# EAGLE schematic Progetto16sens (EAGLE 9.6.2)
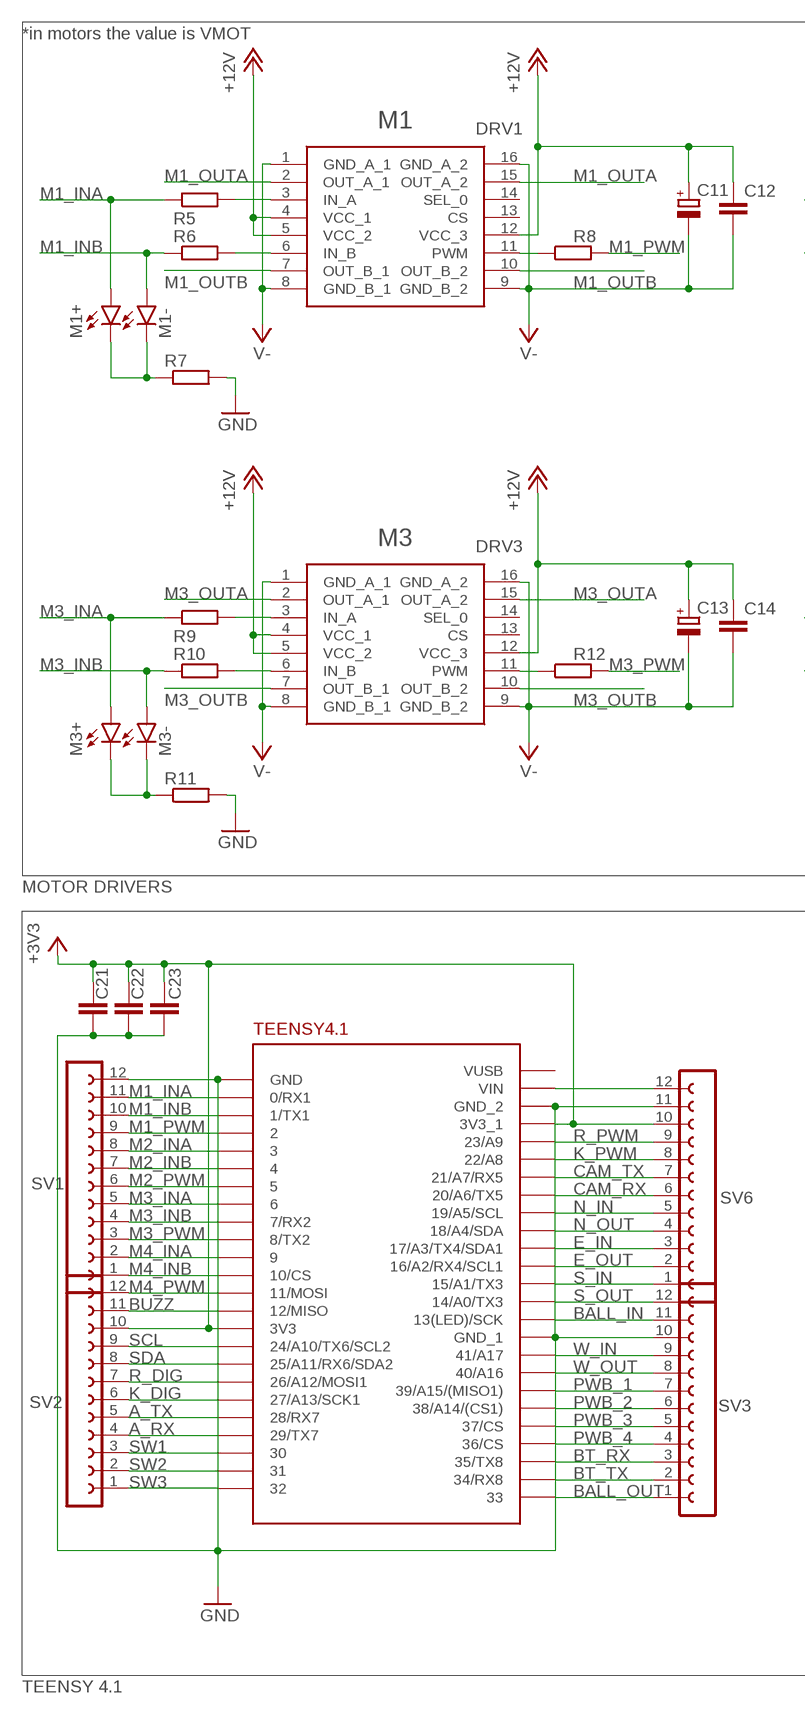
[diagram p0: schematic, sheet 1, part 1 of 2]
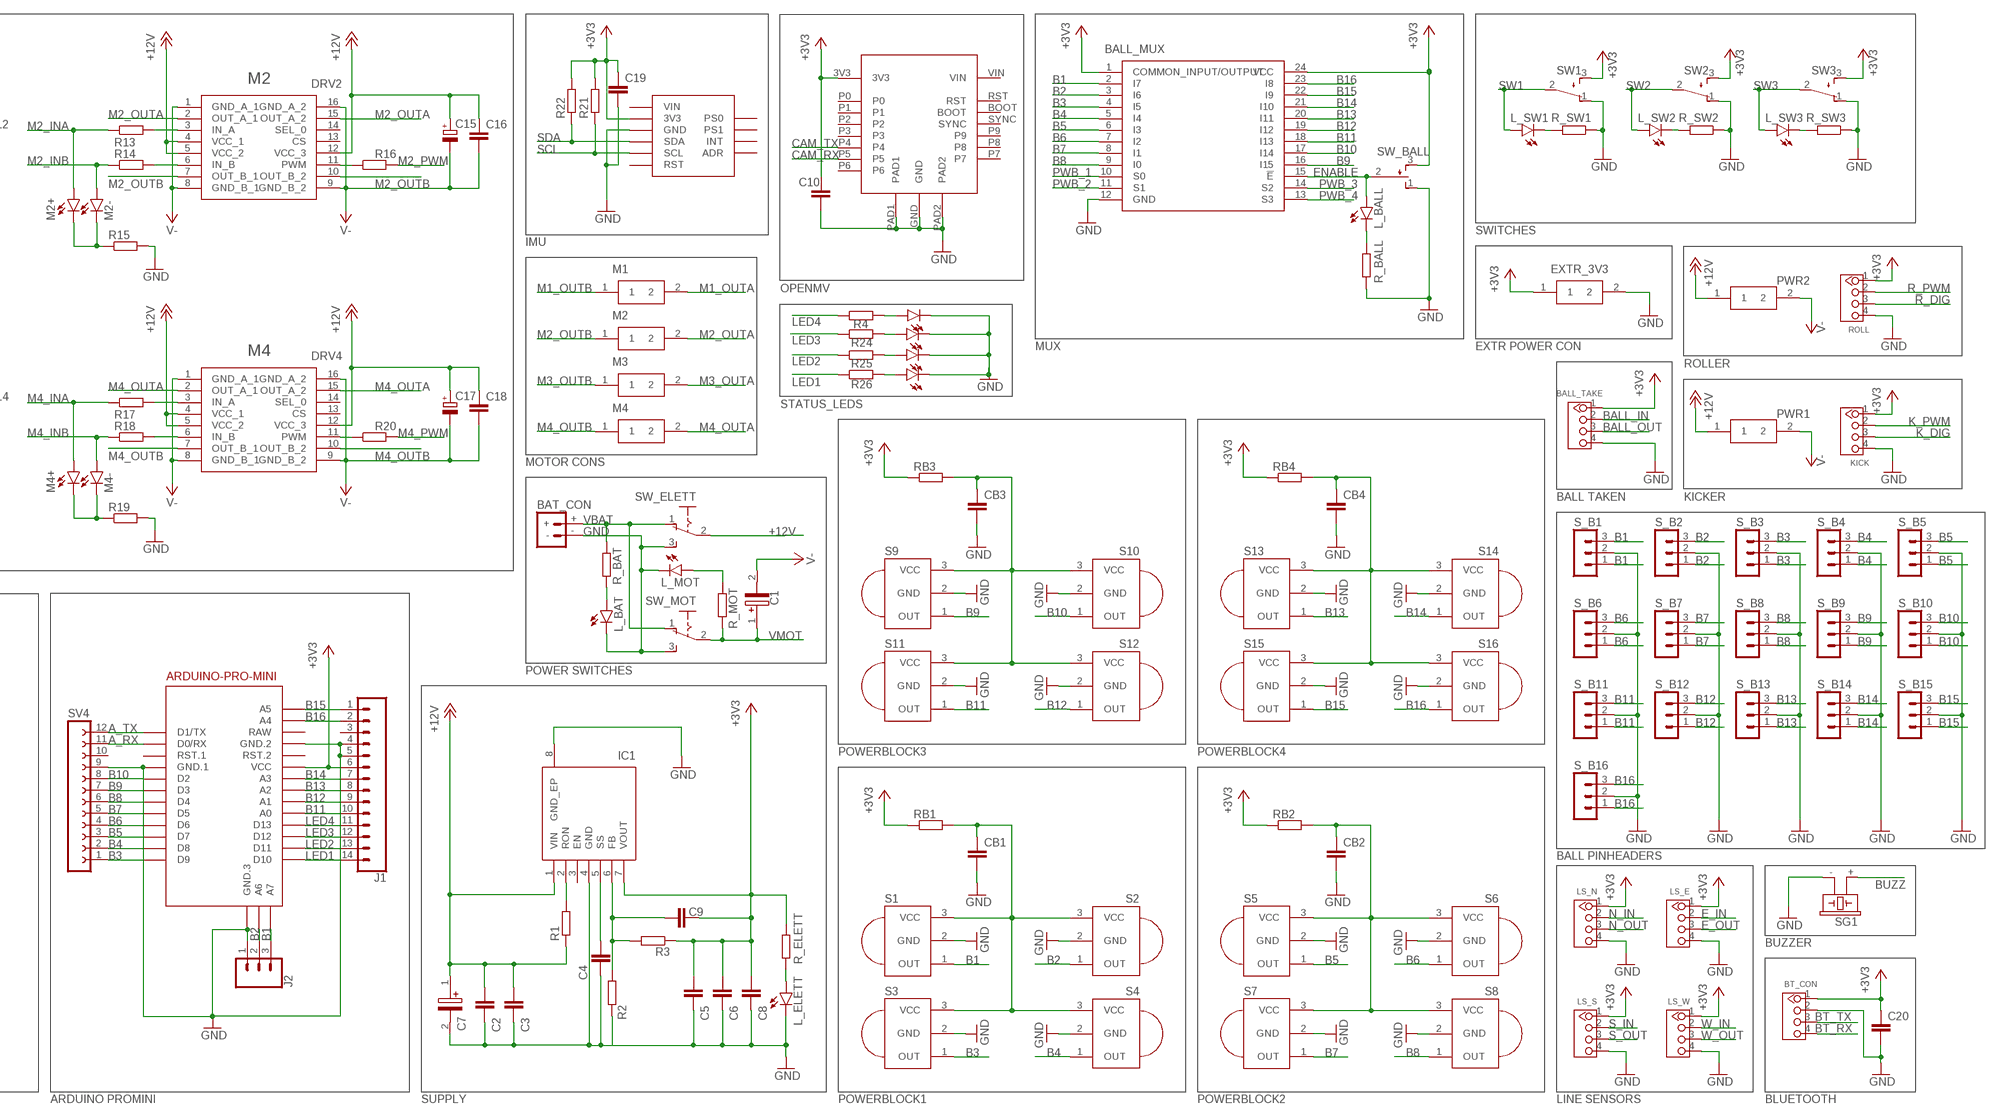
[diagram p1: schematic, sheet 1, part 2 of 2]

## Parts
BALL_MUX  CD74HC4067M  [SOIC127P1030X265-24N]
BALL_TAKE  4P-2.0  GROVE-CONNECTOR-DIP(4P-2.0)  [HW4-2.0]
BAT_CON  BATTERY_CONN_DEANS  [DEANS]
BT_CON  4P-2.0  GROVE-CONNECTOR-DIP(4P-2.0)  [HW4-2.0]
C1  EEV-FK1C152Q  [FKV(H13)]
C2  100n  C-EUC0805  [C0805]
C3  100n  C-EUC0805  [C0805]
C4  22n  C-EUC0805  [C0805]
C5  100u  C-EUC1206  [C1206]
C6  100u  C-EUC1206  [C1206]
C7  EEV-FK1C152Q  [FKV(H13)]
C8  100n  C-EUC0805  [C0805]
C9  22n  C-EUC0805  [C0805]
C10  100u  C-EUC1206  [C1206]
C11  CPOL-EUE  [PANASONIC_E]
C12  C-EUC0805  [C0805]
C13  CPOL-EUE  [PANASONIC_E]
C14  C-EUC0805  [C0805]
C15  CPOL-EUE  [PANASONIC_E]
C16  C-EUC0805  [C0805]
C17  CPOL-EUE  [PANASONIC_E]
C18  C-EUC0805  [C0805]
C19  1u  C-EUC0805  [C0805]
C20  1u  C-EUC0805  [C0805]
C21  C-EUC1206  [C1206]
C22  C-EUC0805  [C0805]
C23  C-EUC0805  [C0805]
CB1  C-EUC0805  [C0805]
CB2  C-EUC0805  [C0805]
CB3  C-EUC0805  [C0805]
CB4  C-EUC0805  [C0805]
DRV1  VNH7070ASTR  [SOIC127P600X175-16N]
DRV2  VNH7070ASTR  [SOIC127P600X175-16N]
DRV3  VNH7070ASTR  [SOIC127P600X175-16N]
DRV4  VNH7070ASTR  [SOIC127P600X175-16N]
EXTR_3V3  43650-0201  [43650-0200]
IC1  LMZ14202TZE-ADJ_NOPB  [NDW0007A]
J1  CONN_14  [1X14]
J2  455-1750-1-ND  CONN_03  [1X03]
KICK  TWIG_2.0  [2.0_1X4]
L_BALL  LEDCHIPLED_1206  [CHIPLED_1206]
L_BAT  LEDCHIPLED_1206  [CHIPLED_1206]
L_ELETT  LEDCHIPLED_1206  [CHIPLED_1206]
L_MOT  LEDCHIPLED_1206  [CHIPLED_1206]
L_SW1  LEDCHIPLED_1206  [CHIPLED_1206]
L_SW2  LEDCHIPLED_1206  [CHIPLED_1206]
L_SW3  LEDCHIPLED_1206  [CHIPLED_1206]
LED1  LEDCHIPLED_1206  [CHIPLED_1206]
LED2  LEDCHIPLED_1206  [CHIPLED_1206]
LED3  LEDCHIPLED_1206  [CHIPLED_1206]
LED4  LEDCHIPLED_1206  [CHIPLED_1206]
LS_E  4P-2.0  GROVE-CONNECTOR-DIP(4P-2.0)  [HW4-2.0]
LS_N  4P-2.0  GROVE-CONNECTOR-DIP(4P-2.0)  [HW4-2.0]
LS_S  4P-2.0  GROVE-CONNECTOR-DIP(4P-2.0)  [HW4-2.0]
LS_W  4P-2.0  GROVE-CONNECTOR-DIP(4P-2.0)  [HW4-2.0]
M1  43650-0201  [43650-0200]
M1+  LEDCHIPLED_1206  [CHIPLED_1206]
M1-  LEDCHIPLED_1206  [CHIPLED_1206]
M2  43650-0201  [43650-0200]
M2+  LEDCHIPLED_1206  [CHIPLED_1206]
M2-  LEDCHIPLED_1206  [CHIPLED_1206]
M3  43650-0201  [43650-0200]
M3+  LEDCHIPLED_1206  [CHIPLED_1206]
M3-  LEDCHIPLED_1206  [CHIPLED_1206]
M4  43650-0201  [43650-0200]
M4+  LEDCHIPLED_1206  [CHIPLED_1206]
M4-  LEDCHIPLED_1206  [CHIPLED_1206]
M5  ARDUINO-PRO-MINI  ARDUINO-PRO-MINI-3.3V#NP  [ARDUINO-PRO-MINI#NP]
PWR1  43650-0201  [43650-0200]
PWR2  43650-0201  [43650-0200]
R1  61,9k  R-EU_M0805  [M0805]
R2  1,07k  R-EU_M0805  [M0805]
R3  3,32k  R-EU_M0805  [M0805]
R4  R-EU_R0805  [R0805]
R5  R-EU_M0805  [M0805]
R6  R-EU_M0805  [M0805]
R7  R-EU_M0805  [M0805]
R8  R-EU_M0805  [M0805]
R9  R-EU_M0805  [M0805]
R10  R-EU_M0805  [M0805]
R11  R-EU_M0805  [M0805]
R12  R-EU_M0805  [M0805]
R13  R-EU_M0805  [M0805]
R14  R-EU_M0805  [M0805]
R15  R-EU_M0805  [M0805]
R16  R-EU_M0805  [M0805]
R17  R-EU_M0805  [M0805]
R18  R-EU_M0805  [M0805]
R19  R-EU_M0805  [M0805]
R20  R-EU_M0805  [M0805]
R21  10k  R-EU_M0805  [M0805]
R22  10k  R-EU_M0805  [M0805]
R24  R-EU_R0805  [R0805]
R25  R-EU_R0805  [R0805]
R26  R-EU_R0805  [R0805]
R_BALL  R-EU_M0805  [M0805]
R_BAT  R-EU_M0805  [M0805]
R_ELETT  R-EU_M0805  [M0805]
R_MOT  R-EU_M0805  [M0805]
R_SW1  R-EU_M0805  [M0805]
R_SW2  R-EU_M0805  [M0805]
R_SW3  R-EU_M0805  [M0805]
RB1  R-EU_M0805  [M0805]
RB2  R-EU_M0805  [M0805]
RB3  R-EU_M0805  [M0805]
RB4  R-EU_M0805  [M0805]
ROLL  TWIG_2.0  [2.0_1X4]
S1  PNA460XM  [PNA460XM]
S2  PNA460XM  [PNA460XM]
S3  PNA460XM  [PNA460XM]
S4  PNA460XM  [PNA460XM]
S5  PNA460XM  [PNA460XM]
S6  PNA460XM  [PNA460XM]
S7  PNA460XM  [PNA460XM]
S8  PNA460XM  [PNA460XM]
S9  PNA460XM  [PNA460XM]
S10  PNA460XM  [PNA460XM]
S11  PNA460XM  [PNA460XM]
S12  PNA460XM  [PNA460XM]
S13  PNA460XM  [PNA460XM]
S14  PNA460XM  [PNA460XM]
S15  PNA460XM  [PNA460XM]
S16  PNA460XM  [PNA460XM]
S_B1  MA03-1  [MA03-1]
S_B2  MA03-1  [MA03-1]
S_B3  MA03-1  [MA03-1]
S_B4  MA03-1  [MA03-1]
S_B5  MA03-1  [MA03-1]
S_B6  MA03-1  [MA03-1]
S_B7  MA03-1  [MA03-1]
S_B8  MA03-1  [MA03-1]
S_B9  MA03-1  [MA03-1]
S_B10  MA03-1  [MA03-1]
S_B11  MA03-1  [MA03-1]
S_B12  MA03-1  [MA03-1]
S_B13  MA03-1  [MA03-1]
S_B14  MA03-1  [MA03-1]
S_B15  MA03-1  [MA03-1]
S_B16  MA03-1  [MA03-1]
SG1  F/CM12P  [F/CM12P]
SV1  FE12-1  [FE12]
SV2  FE12-1  [FE12]
SV3  FE12-1  [FE12]
SV4  FE12-1  [FE12]
SV6  FE12-1  [FE12]
SW1  TL32PO  [TL3XPO]
SW2  TL32PO  [TL3XPO]
SW3  TL32PO  [TL3XPO]
SW_BALL  TL38PO  [TL3XPO]
SW_ELETT  255SB  [255SB]
SW_MOT  255SB  [255SB]
U$1  TEENSY41_EDIT  [TEENSY41_EDIT]
U$2  OPENMV_H7  [OPENMV_H7]
U$3  BNO055_BNO055  [BNO055_BNO055]

## Nets
+3V3: BALL_MUX.1(COMMON_INPUT/OUTPUT) BALL_MUX.24(VCC) BALL_TAKE.1 BT_CON.1 C5.1 C6.1 C8.1 C9.2 C10.1 C19.1 C20.1 C21.1 C22.1 C23.1 EXTR_3V3.1 IC1.7(VOUT) J1.6 KICK.1 LS_E.1 LS_N.1 LS_S.1 LS_W.1 M5.J6.4(VCC) R3.1 R21.2 R22.2 R_ELETT.2 RB1.1 RB2.1 RB3.1 RB4.1 ROLL.1 SV2.10 SV6.10 SW1.3(S) SW2.3(S) SW3.3(S) SW_BALL.3(S) U$1.3V3 U$1.3V3_1 U$2.3V3 U$3.3V3
+12V: C2.1 C3.1 C7.1(+) IC1.1(VIN) R1.1 SW_ELETT.2(P)
A_RX: M5.J7.11(D0/RX) SV2.4 SV4.11 U$1.29/TX7
A_TX: M5.J7.12(D1/TX) SV2.5 SV4.12 U$1.28/RX7
B1: BALL_MUX.2(I7) J2.3 M5.J3.3(A7) S1.1(OUT) S_B1.1 S_B1.3
B2: BALL_MUX.3(I6) J2.2 M5.J3.2(A6) S2.1(OUT) S_B2.1 S_B2.3
B3: BALL_MUX.4(I5) M5.J7.1(D9) S3.1(OUT) S_B3.1 S_B3.3 SV4.1
B4: BALL_MUX.5(I4) M5.J7.2(D8) S4.1(OUT) S_B4.1 S_B4.3 SV4.2
B5: BALL_MUX.6(I3) M5.J7.3(D7) S5.1(OUT) S_B5.1 S_B5.3 SV4.3
B6: BALL_MUX.7(I2) M5.J7.4(D6) S6.1(OUT) S_B6.1 S_B6.3 SV4.4
B7: BALL_MUX.8(I1) M5.J7.5(D5) S7.1(OUT) S_B7.1 S_B7.3 SV4.5
B8: BALL_MUX.9(I0) M5.J7.6(D4) S8.1(OUT) S_B8.1 S_B8.3 SV4.6
B9: BALL_MUX.16(I15) M5.J7.7(D3) S9.1(OUT) S_B9.1 S_B9.3 SV4.7
B10: BALL_MUX.17(I14) M5.J7.8(D2) S10.1(OUT) S_B10.1 S_B10.3 SV4.8
B11: BALL_MUX.18(I13) J1.10 M5.J6.8(A0) S11.1(OUT) S_B11.1 S_B11.3
B12: BALL_MUX.19(I12) J1.9 M5.J6.7(A1) S12.1(OUT) S_B12.1 S_B12.3
B13: BALL_MUX.20(I11) J1.8 M5.J6.6(A2) S13.1(OUT) S_B13.1 S_B13.3
B14: BALL_MUX.21(I10) J1.7 M5.J6.5(A3) S14.1(OUT) S_B14.1 S_B14.3
B15: BALL_MUX.22(I9) J1.1 M5.J2.2(A5) S15.1(OUT) S_B15.1 S_B15.3
B16: BALL_MUX.23(I8) J1.2 M5.J2.1(A4) S16.1(OUT) S_B16.1 S_B16.3
BALL_IN: BALL_TAKE.2 SV3.11 U$1.13(LED)/SCK
BALL_OUT: BALL_TAKE.3 SV3.1 U$1.33
BT_RX: BT_CON.4 SV3.3 U$1.35/TX8
BT_TX: BT_CON.3 SV3.2 U$1.34/RX8
BUZZ: SG1.+ SV2.11 U$1.12/MISO
CAM_RX: SV6.6 U$1.20/A6/TX5 U$2.P5
CAM_TX: SV6.7 U$1.21/A7/RX5 U$2.P4
E_IN: LS_E.2 SV6.3 U$1.17/A3/TX4/SDA1
E_OUT: LS_E.3 SV6.2 U$1.16/A2/RX4/SCL1
ENABLE: BALL_MUX.15(!E) L_BALL.A SW_BALL.2(P)
GND: BALL_MUX.12(GND) BALL_TAKE.4 BAT_CON.- BT_CON.2 C2.2 C3.2 C4.2 C5.2 C6.2 C7.2(-) C8.2 C10.2 C19.2 C20.2 C21.2 C22.2 C23.2 CB1.2 CB2.2 CB3.2 CB4.2 EXTR_3V3.2 IC1.4(GND) IC1.8(GND_EP) J1.4 J1.5 J2.1 KICK.4 L_BAT.C L_ELETT.C L_MOT.C LED1.C LED2.C LED3.C LED4.C LS_E.4 LS_N.4 LS_S.4 LS_W.4 M5.J3.1(GND.3) M5.J6.2(GND.2) M5.J7.9(GND.1) R2.1 R7.2 R11.2 R15.2 R19.2 R_BALL.1 R_SW1.1 R_SW2.1 R_SW3.1 ROLL.4 S1.2(GND) S2.2(GND) S3.2(GND) S4.2(GND) S5.2(GND) S6.2(GND) S7.2(GND) S8.2(GND) S9.2(GND) S10.2(GND) S11.2(GND) S12.2(GND) S13.2(GND) S14.2(GND) S15.2(GND) S16.2(GND) S_B1.2 S_B2.2 S_B3.2 S_B4.2 S_B5.2 S_B6.2 S_B7.2 S_B8.2 S_B9.2 S_B10.2 S_B11.2 S_B12.2 S_B13.2 S_B14.2 S_B15.2 S_B16.2 SG1.- SV1.12 SV3.10 SV4.9 SV6.11 SW1.1(O) SW2.1(O) SW3.1(O) SW_BALL.1(O) SW_ELETT.3(S) SW_MOT.3(S) U$1.GND U$1.GND_1 U$1.GND_2 U$2.GND U$2.PAD1 U$2.PAD2 U$3.GND
K_DIG: KICK.3 SV2.6 U$1.27/A13/SCK1
K_PWM: KICK.2 SV6.8 U$1.22/A8
LED1: J1.14 M5.J6.12(D10) R26.1
LED2: J1.13 M5.J6.11(D11) R25.1
LED3: J1.12 M5.J6.10(D12) R24.1
LED4: J1.11 M5.J6.9(D13) R4.1
M1_INA: M1+.A R5.1 SV1.11 U$1.0/RX1
M1_INB: M1-.A R6.1 SV1.10 U$1.1/TX1
M1_OUTA: DRV1.2(OUT_A_1) DRV1.15(OUT_A_2) M1.2
M1_OUTB: DRV1.7(OUT_B_1) DRV1.10(OUT_B_2) M1.1
M1_PWM: R8.2 SV1.9 U$1.2
M2_INA: M2+.A R13.1 SV1.8 U$1.3
M2_INB: M2-.A R14.1 SV1.7 U$1.4
M2_OUTA: DRV2.2(OUT_A_1) DRV2.15(OUT_A_2) M2.2
M2_OUTB: DRV2.7(OUT_B_1) DRV2.10(OUT_B_2) M2.1
M2_PWM: R16.2 SV1.6 U$1.5
M3_INA: M3+.A R9.1 SV1.5 U$1.6
M3_INB: M3-.A R10.1 SV1.4 U$1.7/RX2
M3_OUTA: DRV3.2(OUT_A_1) DRV3.15(OUT_A_2) M3.2
M3_OUTB: DRV3.7(OUT_B_1) DRV3.10(OUT_B_2) M3.1
M3_PWM: R12.2 SV1.3 U$1.8/TX2
M4_INA: M4+.A R17.1 SV1.2 U$1.9
M4_INB: M4-.A R18.1 SV1.1 U$1.10/CS
M4_OUTA: DRV4.2(OUT_A_1) DRV4.15(OUT_A_2) M4.2
M4_OUTB: DRV4.7(OUT_B_1) DRV4.10(OUT_B_2) M4.1
M4_PWM: R20.2 SV2.12 U$1.11/MOSI
N$1: L_SW2.C R_SW2.2
N$2: L_SW1.C R_SW1.2
N$3: L_SW3.C R_SW3.2
N$4: LED4.A R4.2
N$6: C4.1 IC1.5(SS)
N$7: L_BAT.A R_BAT.2
N$8: L_BALL.C R_BALL.2
N$9: L_MOT.A R_MOT.1
N$10: C9.1 IC1.6(FB) R2.2 R3.2
N$11: IC1.2(RON) R1.2
N$12: L_ELETT.A R_ELETT.1
N$18: LED2.A R25.2
N$19: LED3.A R24.2
N$20: LED1.A R26.2
N$21: M1+.C M1-.C R7.1
N$22: DRV1.3(IN_A) R5.2
N$23: DRV1.6(IN_B) R6.2
N$24: DRV1.11(PWM) R8.1
N$25: DRV3.3(IN_A) R9.2
N$26: DRV3.6(IN_B) R10.2
N$27: M3+.C M3-.C R11.1
N$28: DRV3.11(PWM) R12.1
N$29: DRV2.3(IN_A) R13.2
N$30: DRV2.6(IN_B) R14.2
N$31: M2+.C M2-.C R15.1
N$32: DRV2.11(PWM) R16.1
N$33: DRV4.3(IN_A) R17.2
N$34: DRV4.6(IN_B) R18.2
N$35: M4+.C M4-.C R19.1
N$36: DRV4.11(PWM) R20.1
N$79: SV6.12 U$1.VIN
N_IN: LS_N.2 SV6.5 U$1.19/A5/SCL
N_OUT: LS_N.3 SV6.4 U$1.18/A4/SDA
PWB_1: BALL_MUX.10(S0) SV3.7 U$1.39/A15/(MISO1)
PWB_2: BALL_MUX.11(S1) SV3.6 U$1.38/A14/(CS1)
PWB_3: BALL_MUX.14(S2) SV3.5 U$1.37/CS
PWB_4: BALL_MUX.13(S3) SV3.4 U$1.36/CS
PWR_B1: CB1.1 RB1.2 S1.3(VCC) S2.3(VCC) S3.3(VCC) S4.3(VCC)
PWR_B2: CB2.1 RB2.2 S5.3(VCC) S6.3(VCC) S7.3(VCC) S8.3(VCC)
PWR_B3: CB3.1 RB3.2 S9.3(VCC) S10.3(VCC) S11.3(VCC) S12.3(VCC)
PWR_B4: CB4.1 RB4.2 S13.3(VCC) S14.3(VCC) S15.3(VCC) S16.3(VCC)
R_DIG: ROLL.3 SV2.7 U$1.26/A12/MOSI1
R_PWM: ROLL.2 SV6.9 U$1.23/A9
S_IN: LS_S.2 SV6.1 U$1.15/A1/RX3(15/A1/TX3)
S_OUT: LS_S.3 SV3.12 U$1.14/A0/TX3
SCL: R21.1 SV2.9 U$1.24/A10/TX6/SCL2 U$3.SCL
SDA: R22.1 SV2.8 U$1.25/A11/RX6/SDA2 U$3.SDA
SW1: L_SW1.A SV2.3 SW1.2(P) U$1.30
SW2: L_SW2.A SV2.2 SW2.2(P) U$1.31
SW3: L_SW3.A SV2.1 SW3.2(P) U$1.32
V-: C1.2(-) C11.- C12.2 C13.- C14.2 C15.- C16.2 C17.- C18.2 DRV1.1(GND_A_1) DRV1.8(GND_B_1) DRV1.9(GND_B_2) DRV1.16(GND_A_2) DRV2.1(GND_A_1) DRV2.8(GND_B_1) DRV2.9(GND_B_2) DRV2.16(GND_A_2) DRV3.1(GND_A_1) DRV3.8(GND_B_1) DRV3.9(GND_B_2) DRV3.16(GND_A_2) DRV4.1(GND_A_1) DRV4.8(GND_B_1) DRV4.9(GND_B_2) DRV4.16(GND_A_2) PWR1.2 PWR2.2
VBAT: BAT_CON.+ R_BAT.1 SW_ELETT.1(O) SW_MOT.1(O)
VMOT: C1.1(+) C11.+ C12.1 C13.+ C14.1 C15.+ C16.1 C17.+ C18.1 DRV1.4(VCC_1) DRV1.5(VCC_2) DRV1.12(VCC_3) DRV2.4(VCC_1) DRV2.5(VCC_2) DRV2.12(VCC_3) DRV3.4(VCC_1) DRV3.5(VCC_2) DRV3.12(VCC_3) DRV4.4(VCC_1) DRV4.5(VCC_2) DRV4.12(VCC_3) PWR1.1 PWR2.1 R_MOT.2 SW_MOT.2(P) ; supply symbol labelled +12V
W_IN: LS_W.2 SV3.9 U$1.41/A17
W_OUT: LS_W.3 SV3.8 U$1.40/A16
Unconnected: DRV1.13(CS) DRV1.14(SEL_0) DRV2.13(CS) DRV2.14(SEL_0) DRV3.13(CS) DRV3.14(SEL_0) DRV4.13(CS) DRV4.14(SEL_0) IC1.3(EN) J1.3 M5.J6.3(RST.1) M5.J7.10(RST.2) SV4.10 U$1.VUSB U$2.BOOT U$2.P0 U$2.P1 U$2.P2 U$2.P3 U$2.P6 U$2.P7 U$2.P8 U$2.P9 U$2.RST U$2.SYNC U$2.VIN U$3.ADR U$3.INT U$3.PS0 U$3.PS1 U$3.RST U$3.VIN

## Notes on the sheet
- *in motors the value is VMOT
- M1 | M2
- SWITCHES
- IMU
- OPENMV
- MUX | EXTR POWER CON
- M3 | M4
- ROLLER
- STATUS_LEDS
- MOTOR CONS
- BALL TAKEN | KICKER
- MOTOR DRIVERS
- TEENSY4.1 | POWER SWITCHES
- POWERBLOCK3 | POWERBLOCK4
- BALL PINHEADERS
- BUZZER
- TEENSY 4.1 | ARDUINO PROMINI | SUPPLY | POWERBLOCK1 | POWERBLOCK2 | LINE SENSORS | BLUETOOTH

## Power pins joined to a net without a drawn wire
RAW: M5.J6.1(RAW)

## Library data of the parts
BALL_MUX = CD74HC4067M:CD74HC4067M: High Speed CMOS 16-Ch MUX/DEMUX 24P SOIC Texas Instruments CD74HC4067M, Multiplexer/Demultiplexer Single 16:1, 3 V, 5 V, 24-Pin SOIC Source: Datasheet <http://www.ti.com/lit/ds/symlink/cd74hc4067.pdf>; DESCRIPTION: High Speed CMOS 16-Ch MUX/DEMUX 24P SOIC Texas Instruments CD74HC4067M, Multiplexer/Demultiplexer Single 16:1, 3 V, 5 V, 24-Pin SOIC; HEIGHT: 2.65mm; MANUFACTURER_NAME: Texas Instruments; MANUFACTURER_PART_NUMBER: CD74HC4067M; MOUSER_PART_NUMBER: 595-CD74HC4067M; MOUSER_PRICE-STOCK: https://www.mouser.co.uk/ProductDetail/Texas-Instruments/CD74HC4067M?qs=DcvZ7Fltd5zoWTm6dRwGeQ%3D%3D
BALL_TAKE BT_CON LS_E LS_N LS_S LS_W = OPL_Connector:GROVE-CONNECTOR-DIP(4P-2.0): 320110033
BAT_CON = SparkFun-Connectors:BATTERY_CONN: Battery Connectors Various footprints for battery connections SparkFun Products: Deans Connector -M/F Pair <https://www.sparkfun.com/products/11864>; SF_ID: PRT-11864
C1 C7 = Panasonic 1500uF:EEV-FK1C152Q: PANASONIC ELECTRONIC COMPONENTS - EEV-FK1C152Q - ALUMINUM ELECTROLYTIC CAPACITOR, 1500UF, 16V, 20%, SMD, FULL REEL Source: Datasheet <https://industrial.panasonic.com/cdbs/www-data/pdf/RDE0000/ABA0000C1181.pdf>; ALLIED_NUMBER: 70258729; ALLIED_PRICE-STOCK: https://www.alliedelec.com/panasonic-eev-fk1c152q/70258729/; DESCRIPTION: PANASONIC ELECTRONIC COMPONENTS - EEV-FK1C152Q - ALUMINUM ELECTROLYTIC CAPACITOR, 1500UF, 16V, 20%, SMD, FULL REEL; HEIGHT: mm; MANUFACTURER_NAME: Panasonic; MANUFACTURER_PART_NUMBER: EEV-FK1C152Q; MOUSER_PART_NUMBER: 667-EEV-FK1C152Q; MOUSER_PRICE-STOCK: https://www.mouser.com/Search/Refine.aspx?Keyword=667-EEV-FK1C152Q
C2-C6 C8-C10 C12 C14 C16 C18-C23 CB1-CB4 = rcl:C-EU: CAPACITOR, European symbol; SPICEPREFIX: C
C11 C13 C15 C17 = rcl:CPOL-EU: POLARIZED CAPACITOR, European symbol; SPICEPREFIX: C
DRV1-DRV4 = VNH7070AS:VNH7070ASTR: Motor / Motion / Ignition Controllers & Drivers Source: Datasheet <http://www.st.com/content/ccc/resource/technical/document/datasheet/08/97/0a/0c/cf/4b/41/40/DM00213876.pdf/files/DM00213876.pdf/jcr:content/translations/en.DM00213876.pdf>; DESCRIPTION: Motor / Motion / Ignition Controllers & Drivers; HEIGHT: 1.75mm; MANUFACTURER_NAME: STMicroelectronics; MANUFACTURER_PART_NUMBER: VNH7070ASTR; MOUSER_PART_NUMBER: 511-VNH7070ASTR; MOUSER_PRICE-STOCK: https://www.mouser.com/Search/Refine.aspx?Keyword=511-VNH7070ASTR; RS_PART_NUMBER: 1647017P; RS_PRICE-STOCK: http://uk.rs-online.com/web/p/products/1647017P
EXTR_3V3 M1-M4 PWR1 PWR2 = Molex motori:43650-0201: MOLEX - 43650-0201 - PLUG & SOCKET CONNECTOR, HEADER 2POS 3MM Source: Datasheet <https://www.molex.com/pdm_docs/sd/436500201_sd.pdf>; ALLIED_NUMBER: 70090754; ALLIED_PRICE-STOCK: https://www.alliedelec.com/molex-incorporated-43650-0201/70090754/; DESCRIPTION: MOLEX - 43650-0201 - PLUG & SOCKET CONNECTOR, HEADER 2POS 3MM; HEIGHT: mm; MANUFACTURER_NAME: Molex; MANUFACTURER_PART_NUMBER: 43650-0201; MOUSER_PART_NUMBER: 538-43650-0201; MOUSER_PRICE-STOCK: https://www.mouser.com/Search/Refine.aspx?Keyword=538-43650-0201
IC1 = LMZ14202TZE:LMZ14202TZE-ADJ_NOPB: Voltage Regulators - Switching Regulators 2A pwr Module w/ 42V Max Input Vtg Source: Datasheet <http://www.ti.com/lit/ds/symlink/lmz14202.pdf>; DESCRIPTION: Voltage Regulators - Switching Regulators 2A pwr Module w/ 42V Max Input Vtg; HEIGHT: mm; MANUFACTURER_NAME: Texas Instruments; MANUFACTURER_PART_NUMBER: LMZ14202TZE-ADJ/NOPB; MOUSER_PART_NUMBER: 926-LM14202TZEADJNPB; MOUSER_PRICE-STOCK: https://www.mouser.com/Search/Refine.aspx?Keyword=926-LM14202TZEADJNPB; RS_PART_NUMBER: 7981195P; RS_PRICE-STOCK: http://uk.rs-online.com/web/p/products/7981195P
J1 = SparkFun-Connectors:CONN_14: Multi connection point. Often used as Generic Header-pin footprint for 0.1 inch spaced/style header connections On any of the 0.1 inch spaced packages, you can populate with these: Break Away Headers - Straight <https://www.sparkfun.com/products/116> (PRT-00116) Break Away Male Headers - Right Angle <https://www.sparkfun.com/products/553> (PRT-00553) Female Headers <https://www.sparkfun.com/products/115> (PRT-00115) Break Away Headers - Machine Pin <https://www.sparkfun.com/products/117> (PRT-00117) Break Away Female Headers - Swiss Machine Pin <https://www.sparkfun.com/products/743> (PRT-00743) For SCREWTERMINALS and SPRING TERMINALS visit here: Screw Terimnals on SparkFun.com <https://www.sparkfun.com/search/results?term=Screw+Terminals> (5mm/3.5mm/2.54mm spacing) This device is also useful as a general connection point to wire up your design to another part of your project. Our various solder wires solder well into these plated through hole pads. Hook-Up Wire - Assortment (Stranded, 22 AWG) <https://www.sparkfun.com/products/11375> (PRT-11375) Hook-Up Wire - Assortment (Solid Core, 22 AWG) <https://www.sparkfun.com/products/11367> (PRT-11367) View the entire wire category on our website here <https://www.sparkfun.com/categories/141> Special notes: Molex polarized connector foot print use with SKU : PRT-08231 with associated crimp pins and housings. 1MM SMD Version SKU: PRT-10208 NOTES ON THE VARIANTS LOCK and LOCK_LONGPADS... This footprint was designed to help hold the alignment of a through-hole component (i.e. 6-pin header) while soldering it into place. You may notice that each hole has been shifted either up or down by 0.005 of an inch from it's more standard position (which is a perfectly straight line). This slight alteration caused the pins (the squares in the middle) to touch the edges of the holes. Because they are alternating, it causes a "brace" to hold the component in place. 0.005 has proven to be the perfect amount of "off-center" position when using our standard breakaway headers. Although looks a little odd when you look at the bare footprint, once you have a header in there, the alteration is very hard to notice. Also,if you push a header all the way into place, it is covered up entirely on the bottom side.
J2 = SparkFun-Connectors:CONN_03: Multi connection point. Often used as Generic Header-pin footprint for 0.1 inch spaced/style header connections On any of the 0.1 inch spaced packages, you can populate with these: Break Away Headers - Straight <https://www.sparkfun.com/products/116> (PRT-00116) Break Away Male Headers - Right Angle <https://www.sparkfun.com/products/553> (PRT-00553) Female Headers <https://www.sparkfun.com/products/115> (PRT-00115) Break Away Headers - Machine Pin <https://www.sparkfun.com/products/117> (PRT-00117) Break Away Female Headers - Swiss Machine Pin <https://www.sparkfun.com/products/743> (PRT-00743) Stackable Header - 3 Pin (Female, 0.1") <https://www.sparkfun.com/products/13875> (PRT-13875) For SCREWTERMINALS and SPRING TERMINALS visit here: Screw Terimnals on SparkFun.com <https://www.sparkfun.com/search/results?term=Screw+Terminals> (5mm/3.5mm/2.54mm spacing) This device is also useful as a general connection point to wire up your design to another part of your project. Our various solder wires solder well into these plated through hole pads. Hook-Up Wire - Assortment (Stranded, 22 AWG) <https://www.sparkfun.com/products/11375> (PRT-11375) Hook-Up Wire - Assortment (Solid Core, 22 AWG) <https://www.sparkfun.com/products/11367> (PRT-11367) View the entire wire category on our website here <https://www.sparkfun.com/categories/141> Special notes: Molex polarized connector foot print use with SKU : PRT-08232 with associated crimp pins and housings.; PROD_ID: XXX-00000
KICK ROLL = CONNECTER:TWIG_2.0
L_BALL L_BAT L_ELETT L_MOT L_SW1-L_SW3 LED1-LED4 M1+ M1- M2+ M2- M3+ M3- M4+ M4- = led:LED: LED OSRAM: - CHIPLED LG R971, LG N971, LY N971, LG Q971, LY Q971, LO R971, LY R971 LH N974, LH R974 LS Q976, LO Q976, LY Q976 LO Q996 - Hyper CHIPLED LW Q18S LB Q993, LB Q99A, LB R99A - SideLED LS A670, LO A670, LY A670, LG A670, LP A670 LB A673, LV A673, LT A673, LW A673 LH A674 LY A675 LS A676, LA A676, LO A676, LY A676, LW A676 LS A679, LY A679, LG A679 - Hyper Micro SIDELED® LS Y876, LA Y876, LO Y876, LY Y876 LT Y87S - SmartLED LW L88C, LW L88S LB L89C, LB L89S, LG L890 LS L89K, LO L89K, LY L89K LS L896, LA L896, LO L896, LY L896 - TOPLED LS T670, LO T670, LY T670, LG T670, LP T670 LSG T670, LSP T670, LSY T670, LOP T670, LYG T670 LG T671, LOG T671, LSG T671 LB T673, LV T673, LT T673, LW T673 LH T674 LS T676, LA T676, LO T676, LY T676, LB T676, LH T676, LSB T676, LW T676 LB T67C, LV T67C, LT T67C, LS T67K, LO T67K, LY T67K, LW E67C LS E67B, LA E67B, LO E67B, LY E67B, LB E67C, LV E67C, LT E67C LW T67C LS T679, LY T679, LG T679 LS T770, LO T770, LY T770, LG T770, LP T770 LB T773, LV T773, LT T773, LW T773 LH T774 LS E675, LA E675, LY E675, LS T675 LS T776, LA T776, LO T776, LY T776, LB T776 LHGB T686 LT T68C, LB T68C - Hyper Mini TOPLED® LB M676 - Mini TOPLED Santana® LG M470 LS M47K, LO M47K, LY M47K Source: http://www.osram.convergy.de LUXEON: - LUMILED® LXK2-PW12-R00, LXK2-PW12-S00, LXK2-PW14-U00, LXK2-PW14-V00 LXK2-PM12-R00, LXK2-PM12-S00, LXK2-PM14-U00 LXK2-PE12-Q00, LXK2-PE12-R00, LXK2-PE12-S00, LXK2-PE14-T00, LXK2-PE14-U00 LXK2-PB12-K00, LXK2-PB12-L00, LXK2-PB12-M00, LXK2-PB14-N00, LXK2-PB14-P00, LXK2-PB14-Q00 LXK2-PR12-L00, LXK2-PR12-M00, LXK2-PR14-Q00, LXK2-PR14-R00 LXK2-PD12-Q00, LXK2-PD12-R00, LXK2-PD12-S00 LXK2-PH12-R00, LXK2-PH12-S00 LXK2-PL12-P00, LXK2-PL12-Q00, LXK2-PL12-R00 Source: www.luxeon.com KINGBRIGHT: KA-3528ASYC Source: www.kingbright.com
M5 = arduinopromininew:ARDUINO-PRO-MINI-*#NP: Arduino Pro Mini (and compatible devices) without programming pads More details available here: https://www.arduino.cc/en/Main/ArduinoBoardProMini Click here to find device on ebay.com <http://www.ebay.com/sch/arduino+pro+mini>
R1-R22 R24-R26 R_BALL R_BAT R_ELETT R_MOT R_SW1-R_SW3 RB1-RB4 = rcl:R-EU_: RESISTOR, European symbol; SPICEPREFIX: R
S1-S16 = adafruit:PNA460XM: IR 38KHz receiver PNA4602 and related receivers http://www.ladyada.net/library/pcb/eaglelibrary.html
S_B1-S_B16 = con-lstb:MA03-1: PIN HEADER; OC_FARNELL: unknown; OC_NEWARK: unknown
SG1 = buzzer:F/CM12P: BUZZER Source: Buerklin; OC_FARNELL: unknown; OC_NEWARK: unknown
SV1-SV4 SV6 = con-lsta:FE12-1: FEMALE HEADER; OC_FARNELL: unknown; OC_NEWARK: unknown
SW1-SW3 = switch:TL32PO: TINY SWITCH ON - MOM Source: http://www2.produktinfo.conrad.com/datenblaetter/700000-724999/705152-da-01-de-Subminiaturschalter_TL_36YO.pdf
SW_BALL = switch:TL38PO: TINY SWITCH ON OFF MOM Source: http://www2.produktinfo.conrad.com/datenblaetter/700000-724999/705152-da-01-de-Subminiaturschalter_TL_36YO.pdf
SW_ELETT SW_MOT = switch_modified:255SB: SLIDING SWITCH Distributor Buerklin, 11G810
U$1 = teensy:TEENSY41_EDIT
U$2 = OpenMV:OPENMV_H7
U$3 = IMU:BNO055_BNO055